# Altium schematic sheet Relay_Sheet.SchDoc
size 420 x 297 mm; SheetNumber: 8; SheetTotal: 10
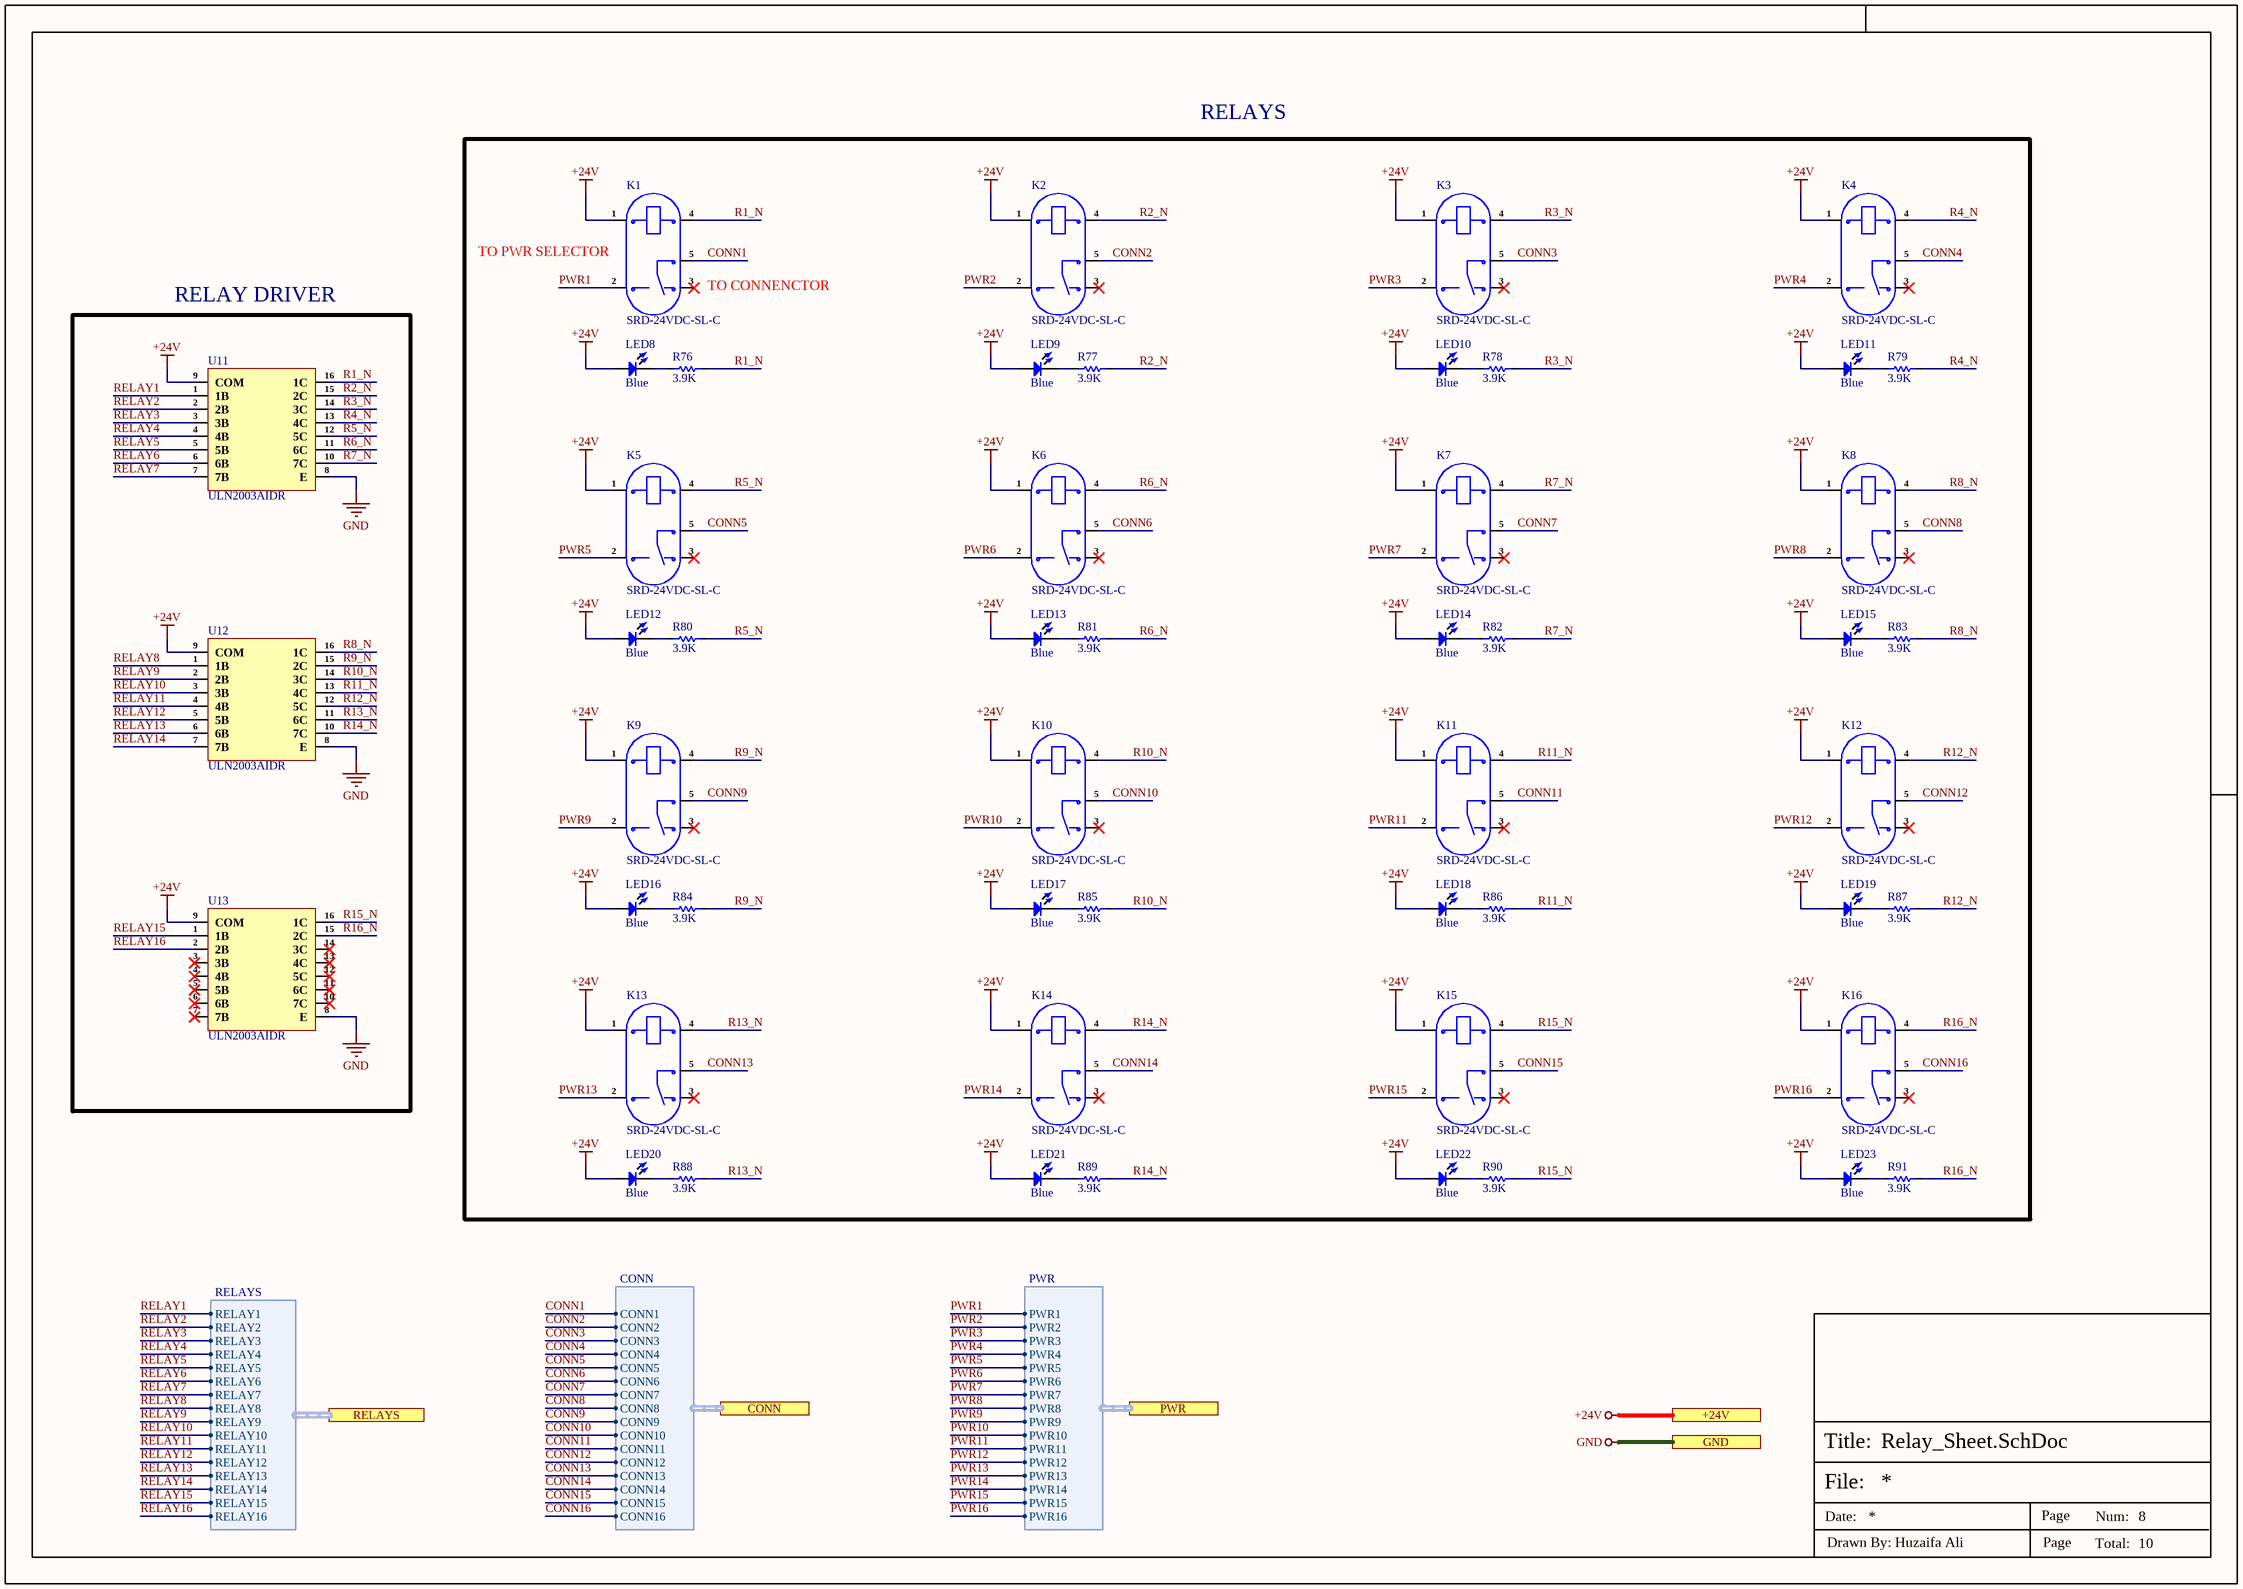
[diagram p0: Relay_Sheet.SchDoc]

## Parts
K1  SRD-24VDC-SL-C  [SRD-24VDC-SL-C]
K2  SRD-24VDC-SL-C  [SRD-24VDC-SL-C]
K3  SRD-24VDC-SL-C  [SRD-24VDC-SL-C]
K4  SRD-24VDC-SL-C  [SRD-24VDC-SL-C]
K5  SRD-24VDC-SL-C  [SRD-24VDC-SL-C]
K6  SRD-24VDC-SL-C  [SRD-24VDC-SL-C]
K7  SRD-24VDC-SL-C  [SRD-24VDC-SL-C]
K8  SRD-24VDC-SL-C  [SRD-24VDC-SL-C]
K9  SRD-24VDC-SL-C  [SRD-24VDC-SL-C]
K10  SRD-24VDC-SL-C  [SRD-24VDC-SL-C]
K11  SRD-24VDC-SL-C  [SRD-24VDC-SL-C]
K12  SRD-24VDC-SL-C  [SRD-24VDC-SL-C]
K13  SRD-24VDC-SL-C  [SRD-24VDC-SL-C]
K14  SRD-24VDC-SL-C  [SRD-24VDC-SL-C]
K15  SRD-24VDC-SL-C  [SRD-24VDC-SL-C]
K16  SRD-24VDC-SL-C  [SRD-24VDC-SL-C]
LED8  Blue  [LED-0603]
LED9  Blue  [LED-0603]
LED10  Blue  [LED-0603]
LED11  Blue  [LED-0603]
LED12  Blue  [LED-0603]
LED13  Blue  [LED-0603]
LED14  Blue  [LED-0603]
LED15  Blue  [LED-0603]
LED16  Blue  [LED-0603]
LED17  Blue  [LED-0603]
LED18  Blue  [LED-0603]
LED19  Blue  [LED-0603]
LED20  Blue  [LED-0603]
LED21  Blue  [LED-0603]
LED22  Blue  [LED-0603]
LED23  Blue  [LED-0603]
R76  3.9K  [Res-0402]
R77  3.9K  [Res-0402]
R78  3.9K  [Res-0402]
R79  3.9K  [Res-0402]
R80  3.9K  [Res-0402]
R81  3.9K  [Res-0402]
R82  3.9K  [Res-0402]
R83  3.9K  [Res-0402]
R84  3.9K  [Res-0402]
R85  3.9K  [Res-0402]
R86  3.9K  [Res-0402]
R87  3.9K  [Res-0402]
R88  3.9K  [Res-0402]
R89  3.9K  [Res-0402]
R90  3.9K  [Res-0402]
R91  3.9K  [Res-0402]
U11  ULN2003AIDR  [16-SOIC (0.154", 3.90mm Width)]
U12  ULN2003AIDR  [16-SOIC (0.154", 3.90mm Width)]
U13  ULN2003AIDR  [16-SOIC (0.154", 3.90mm Width)]

## Blocks framed on the sheet
RELAYS: K1-K16 LED8-LED23 R76-R91
RELAY DRIVER: U11-U13

## Ports
+24V (see Top_Sheet[2B], Connector_Sheet[5D], Power_Sheet[5D], Relay_PWR_Sheet[5D]), CONN (harness CONN, see Top_Sheet[2C], Connector_Sheet[4D]), GND (see Top_Sheet[2C], CAN_Sheet[5D], Connector_Sheet[5D], Controller_Sheet[5D], EtherCAT_Sheet[5D], Power_Sheet[5D], RJ45_Sheet[5D], RS485_RS232_Sheet[5D]), PWR (harness PWR, see Top_Sheet[2C], Relay_PWR_Sheet[1D]), RELAYS (harness RELAYS, see Top_Sheet[3B], Controller_Sheet[4D])

## Harnesses
RELAYS: RELAY1, RELAY2, RELAY3, RELAY4, RELAY5, RELAY6, RELAY7, RELAY8, RELAY9, RELAY10, RELAY11, RELAY12, RELAY13, RELAY14, RELAY15, RELAY16
CONN: CONN1, CONN2, CONN3, CONN4, CONN5, CONN6, CONN7, CONN8, CONN9, CONN10, CONN11, CONN12, CONN13, CONN14, CONN15, CONN16
PWR: PWR1, PWR2, PWR3, PWR4, PWR5, PWR6, PWR7, PWR8, PWR9, PWR10, PWR11, PWR12, PWR13, PWR14, PWR15, PWR16

## Nets
+24V: K1.1 K2.1 K3.1 K4.1 K5.1 K6.1 K7.1 K8.1 K9.1 K10.1 K11.1 K12.1 K13.1 K14.1 K15.1 K16.1 LED8.1 LED9.1 LED10.1 LED11.1 LED12.1 LED13.1 LED14.1 LED15.1 LED16.1 LED17.1 LED18.1 LED19.1 LED20.1 LED21.1 LED22.1 LED23.1 U11.9(COM) U12.9(COM) U13.9(COM) ; port +24V
GND: U11.8(E) U12.8(E) U13.8(E) ; port GND
CONN1: K1.5 ; port CONN.CONN1
CONN2: K2.5 ; port CONN.CONN2
CONN3: K3.5 ; port CONN.CONN3
CONN4: K4.5 ; port CONN.CONN4
CONN5: K5.5 ; port CONN.CONN5
CONN6: K6.5 ; port CONN.CONN6
CONN7: K7.5 ; port CONN.CONN7
CONN8: K8.5 ; port CONN.CONN8
CONN9: K9.5 ; port CONN.CONN9
CONN10: K10.5 ; port CONN.CONN10
CONN11: K11.5 ; port CONN.CONN11
CONN12: K12.5 ; port CONN.CONN12
CONN13: K13.5 ; port CONN.CONN13
CONN14: K14.5 ; port CONN.CONN14
CONN15: K15.5 ; port CONN.CONN15
CONN16: K16.5 ; port CONN.CONN16
PWR1: K1.2 ; port PWR.PWR1
PWR2: K2.2 ; port PWR.PWR2
PWR3: K3.2 ; port PWR.PWR3
PWR4: K4.2 ; port PWR.PWR4
PWR5: K5.2 ; port PWR.PWR5
PWR6: K6.2 ; port PWR.PWR6
PWR7: K7.2 ; port PWR.PWR7
PWR8: K8.2 ; port PWR.PWR8
PWR9: K9.2 ; port PWR.PWR9
PWR10: K10.2 ; port PWR.PWR10
PWR11: K11.2 ; port PWR.PWR11
PWR12: K12.2 ; port PWR.PWR12
PWR13: K13.2 ; port PWR.PWR13
PWR14: K14.2 ; port PWR.PWR14
PWR15: K15.2 ; port PWR.PWR15
PWR16: K16.2 ; port PWR.PWR16
R1_N: K1.4 R76.2 U11.16(1C)
R2_N: K2.4 R77.2 U11.15(2C)
R3_N: K3.4 R78.2 U11.14(3C)
R4_N: K4.4 R79.2 U11.13(4C)
R5_N: K5.4 R80.2 U11.12(5C)
R6_N: K6.4 R81.2 U11.11(6C)
R7_N: K7.4 R82.2 U11.10(7C)
R8_N: K8.4 R83.2 U12.16(1C)
R9_N: K9.4 R84.2 U12.15(2C)
R10_N: K10.4 R85.2 U12.14(3C)
R11_N: K11.4 R86.2 U12.13(4C)
R12_N: K12.4 R87.2 U12.12(5C)
R13_N: K13.4 R88.2 U12.11(6C)
R14_N: K14.4 R89.2 U12.10(7C)
R15_N: K15.4 R90.2 U13.16(1C)
R16_N: K16.4 R91.2 U13.15(2C)
RELAY1: U11.1(1B) ; port RELAYS.RELAY1
RELAY2: U11.2(2B) ; port RELAYS.RELAY2
RELAY3: U11.3(3B) ; port RELAYS.RELAY3
RELAY4: U11.4(4B) ; port RELAYS.RELAY4
RELAY5: U11.5(5B) ; port RELAYS.RELAY5
RELAY6: U11.6(6B) ; port RELAYS.RELAY6
RELAY7: U11.7(7B) ; port RELAYS.RELAY7
RELAY8: U12.1(1B) ; port RELAYS.RELAY8
RELAY9: U12.2(2B) ; port RELAYS.RELAY9
RELAY10: U12.3(3B) ; port RELAYS.RELAY10
RELAY11: U12.4(4B) ; port RELAYS.RELAY11
RELAY12: U12.5(5B) ; port RELAYS.RELAY12
RELAY13: U12.6(6B) ; port RELAYS.RELAY13
RELAY14: U12.7(7B) ; port RELAYS.RELAY14
RELAY15: U13.1(1B) ; port RELAYS.RELAY15
RELAY16: U13.2(2B) ; port RELAYS.RELAY16
NetLED8_2: LED8.2 R76.1
NetLED9_2: LED9.2 R77.1
NetLED10_2: LED10.2 R78.1
NetLED11_2: LED11.2 R79.1
NetLED12_2: LED12.2 R80.1
NetLED13_2: LED13.2 R81.1
NetLED14_2: LED14.2 R82.1
NetLED15_2: LED15.2 R83.1
NetLED16_2: LED16.2 R84.1
NetLED17_2: LED17.2 R85.1
NetLED18_2: LED18.2 R86.1
NetLED19_2: LED19.2 R87.1
NetLED20_2: LED20.2 R88.1
NetLED21_2: LED21.2 R89.1
NetLED22_2: LED22.2 R90.1
NetLED23_2: LED23.2 R91.1

Not connected (* = marked no-connect by the designer): K1 3*; K2 3*; K3 3*; K4 3*; K5 3*; K6 3*; K7 3*; K8 3*; K9 3*; K10 3*; K11 3*; K12 3*; K13 3*; K14 3*; K15 3*; K16 3*; U13 3(3B)* 4(4B)* 5(5B)* 6(6B)* 7(7B)* 10(7C)* 11(6C)* 12(5C)* 13(4C)* 14(3C)*

## Notes on the sheet
- (near K1) TO PWR SELECTOR
- (near K1) TO CONNENCTOR
- File:
- Title:
- Date:
- Page
- Num:
- Total:
- Drawn By: Huzaifa Ali

## Library data of the parts
K1-K16 = SRD-24VDC-SL-C: 250V@AC 24V 15A SPDT (1 Form C) Plugin,15.6x19.2mm Power Relays ROHS; Manufacturer: Ningbo Forward Relay; Item Type: Relay; Supplier: LCSC; LCSC Part Number: C15840; Manufacturer Part Number: SRD-24VDC-SL-C; RoHS: No
LED8-LED23 = NCD0603B3: blue 0603 Light Emitting Diodes (LED) ROHS; Manufacturer: Foshan NationStar Optoelectronics; Manufacturer Part Number: NCD0603B3; Package: 0603; LCSC Part Number: C158101; Item Type: LED; ComponentLink1Description: LCSC; ComponentLink1URL: https://www.lcsc.com/product-detail/Light-Emitting-Diodes-LED_Foshan-NationStar-Optoelectronics-NCD0603B3_C158101.html
R76-R91 = RC0402FR-073K9L: RES 3.9K OHM 1% 1/16W 0402; Manufacturer: Yageo; Temperature Coefficient: 100ppm/°C; Power Rating: 62.5mW; Value: 3.9kR; Voltage Rating: 50V; Max Power Dissipation: 63mW; Item Type: Resistor; Supplier: Future Electronics; Supplier Part Number: 9808155; Manufacturer Part Number: RC0402FR-073K9L; RoHS: Yes; Category: Chip SMD Resistors; Stock: 6910000; Pricing: 10000=0.0011, 100000=0.0011, 300000=0.001, 750000=0.001, 2000000=0.0009 (USD); Case/Package: 0402; Case Code (Imperial): 0402; Case Code (Metric): 1005; Min Operating Temperature: -55°C; Max Operating Temperature: 155°C; Tolerance: 1%; Packaging: Tape and Reel; Resistor Type: Thick Film; Series: RC; Termination: SMD/SMT; Number of Terminations: 2; Features: Moisture Resistant; Resistance Tolerance: 1%; Construction: Rectangular; Voltage Rating (AC): 50V; Length: 1mm; Depth: 0.5mm; Lead Free: Lead Free; RoHS Compliant: Yes; Reach SVHC Compliant: Unknown; Military Standard: Not; ComponentLink1URL: https://datasheet.ciiva.com/12666/pyu-rc0402-51-rohs-l-6-r-12666997.pdf?src-supplier=Mouser; ComponentLink1Description: https://datasheet.ciiva.com/12666/pyu-rc0402-51-rohs-l-6-r-12666997.pdf?src-supplier=Mouser; ComponentLink2URL: https://datasheet.ciiva.com/7849/1018594-7849989.pdf?src-supplier=Element14; ComponentLink2Description: https://datasheet.ciiva.com/7849/1018594-7849989.pdf?src-supplier=Element14; ComponentLink3URL: https://datasheet.ciiva.com/7849/1018594-7849990.pdf?src-supplier=Element14; ComponentLink3Description: https://datasheet.ciiva.com/7849/1018594-7849990.pdf?src-supplier=Element14; ComponentLink4URL: https://datasheet.ciiva.com/15189/getdatasheetpartid-469246-15189453.pdf?src-supplier=Verical; ComponentLink4Description: https://datasheet.ciiva.com/15189/getdatasheetpartid-469246-15189453.pdf?src-supplier=Verical; LCSC Part Number: C131467
U11-U13 = ULN2003AIDR: IC PWR RELAY 7NPN 1:1 16SOIC; Manufacturer: Texas Instruments; Supplier: Mouser; Supplier Part Number: 595-ULN2003AIDR; Manufacturer Part Number: ULN2003AIDR; RoHS: Yes; Item Type: IC; Stock: 2012; Pricing: 1=0.66, 10=0.589, 50=0.589, 100=0.402, 1000=0.285, 10000=0.232 (USD); ComponentLink1URL: https://datasheet.ciiva.com/15139/getdatasheetpartid-47948-15139878.pdf?src-supplier=Verical; ComponentLink1Description: https://datasheet.ciiva.com/15139/getdatasheetpartid-47948-15139878.pdf?src-supplier=Verical; ComponentLink2URL: https://datasheet.ciiva.com/14424/ulq2003a-14424030.pdf?src-supplier=Avnet; ComponentLink2Description: https://datasheet.ciiva.com/14424/ulq2003a-14424030.pdf?src-supplier=Avnet; ComponentLink3URL: https://datasheet.ciiva.com/1700/uln2003ai-1700820.pdf?src-supplier=Digikey; ComponentLink3Description: https://datasheet.ciiva.com/1700/uln2003ai-1700820.pdf?src-supplier=Digikey; ComponentLink4URL: https://datasheet.ciiva.com/1700/uln2003ai-1700821.pdf?src-supplier=Digikey; ComponentLink4Description: https://datasheet.ciiva.com/1700/uln2003ai-1700821.pdf?src-supplier=Digikey; ComponentLink5URL: https://datasheet.ciiva.com/1700/uln2003ai-1700822.pdf?src-supplier=Digikey; ComponentLink5Description: https://datasheet.ciiva.com/1700/uln2003ai-1700822.pdf?src-supplier=Digikey